# Altium project Main_Project.PrjPcb
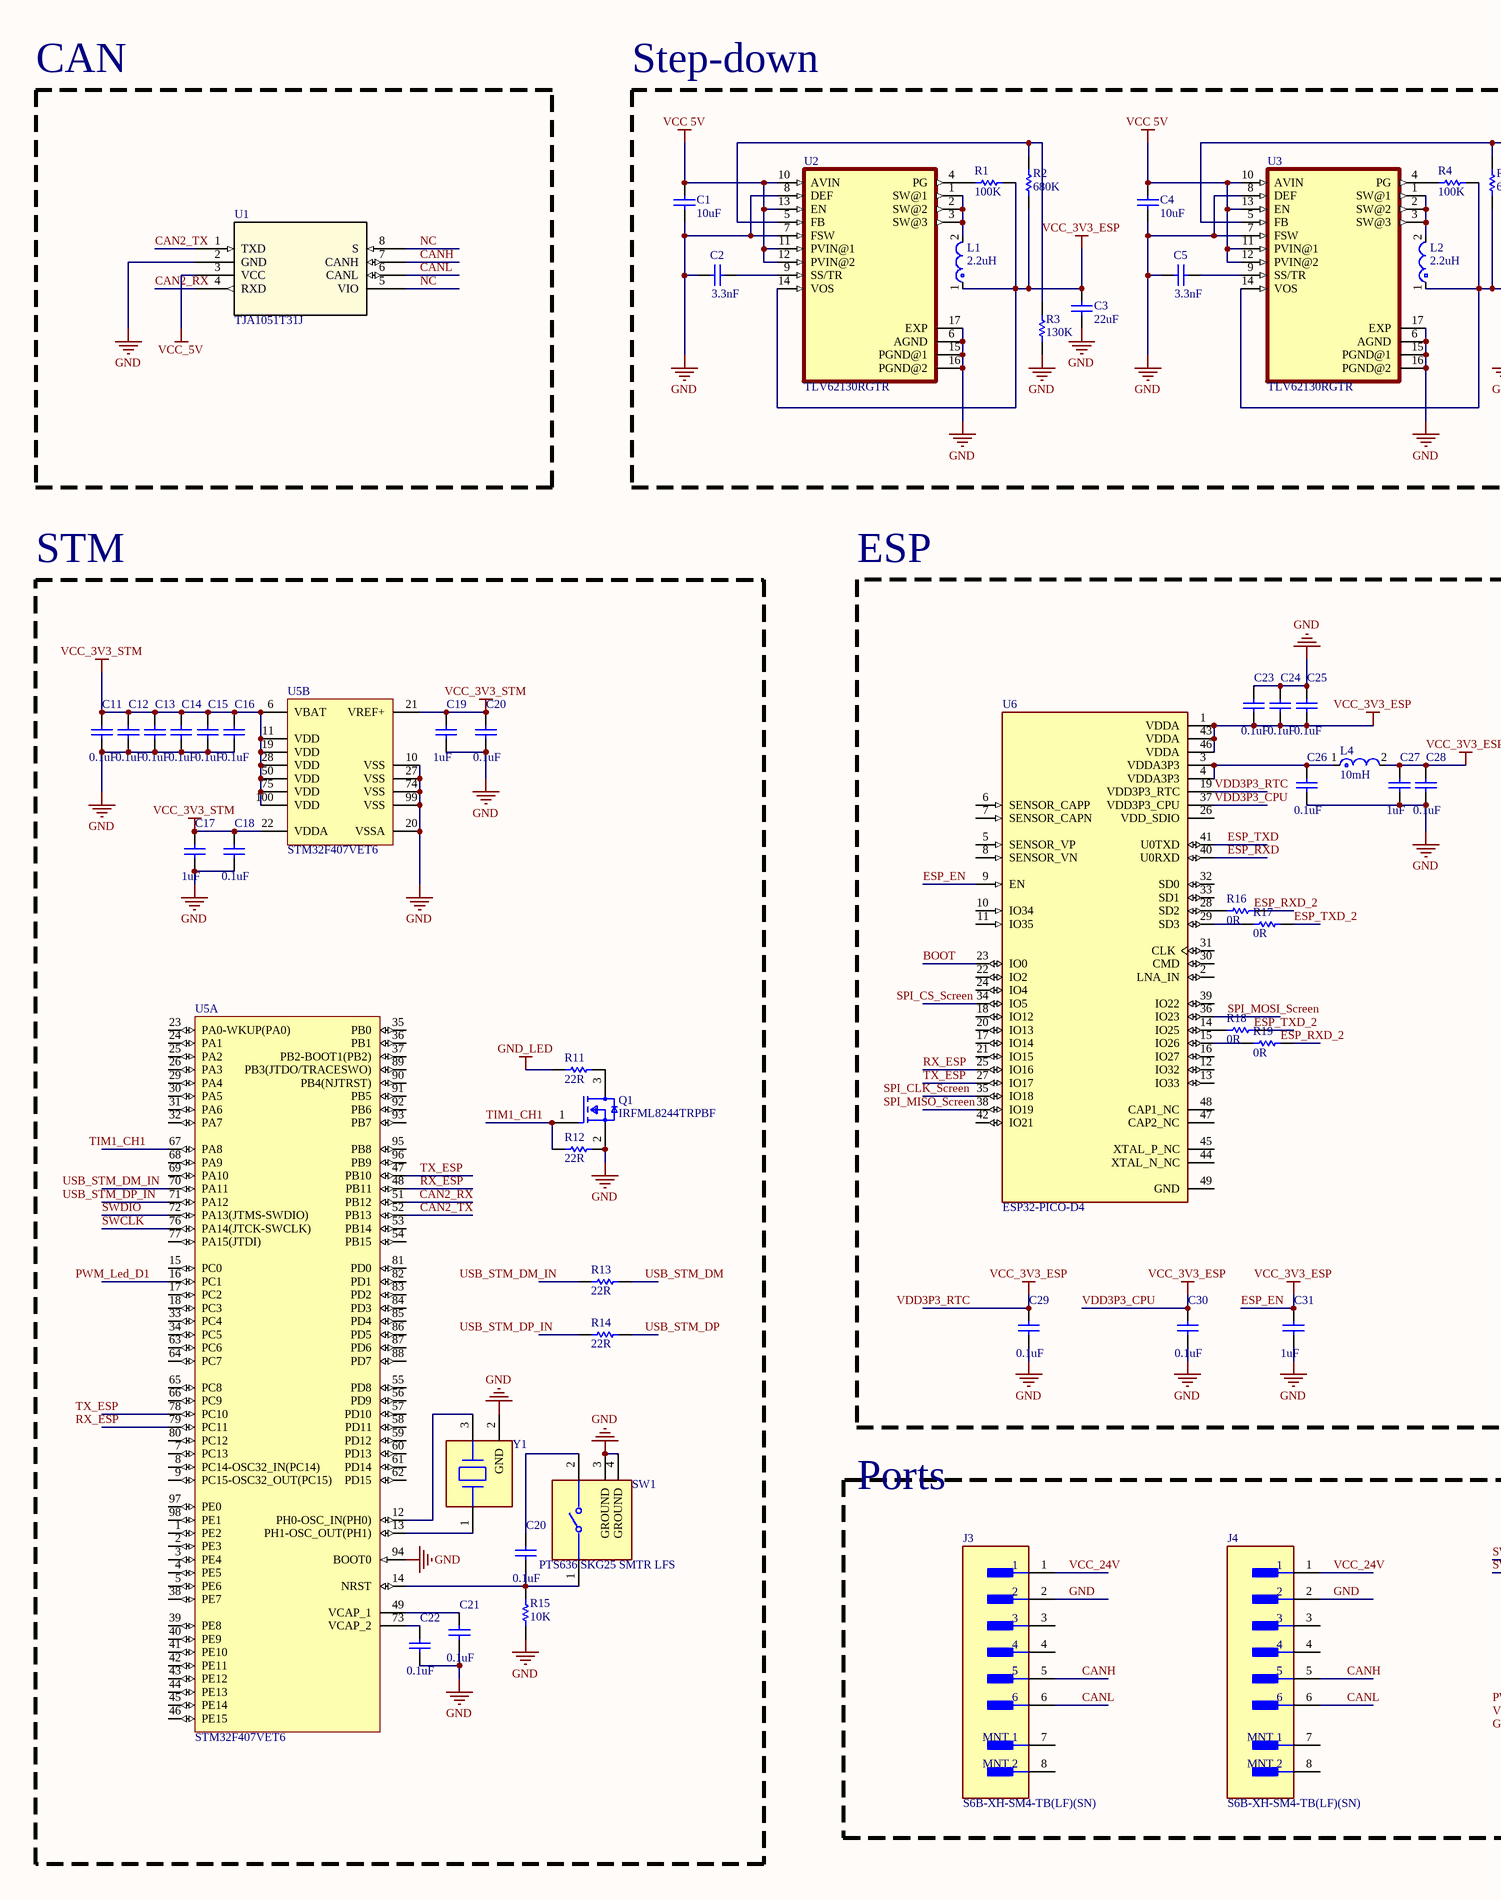
[diagram p0: Main.SchDoc, left]
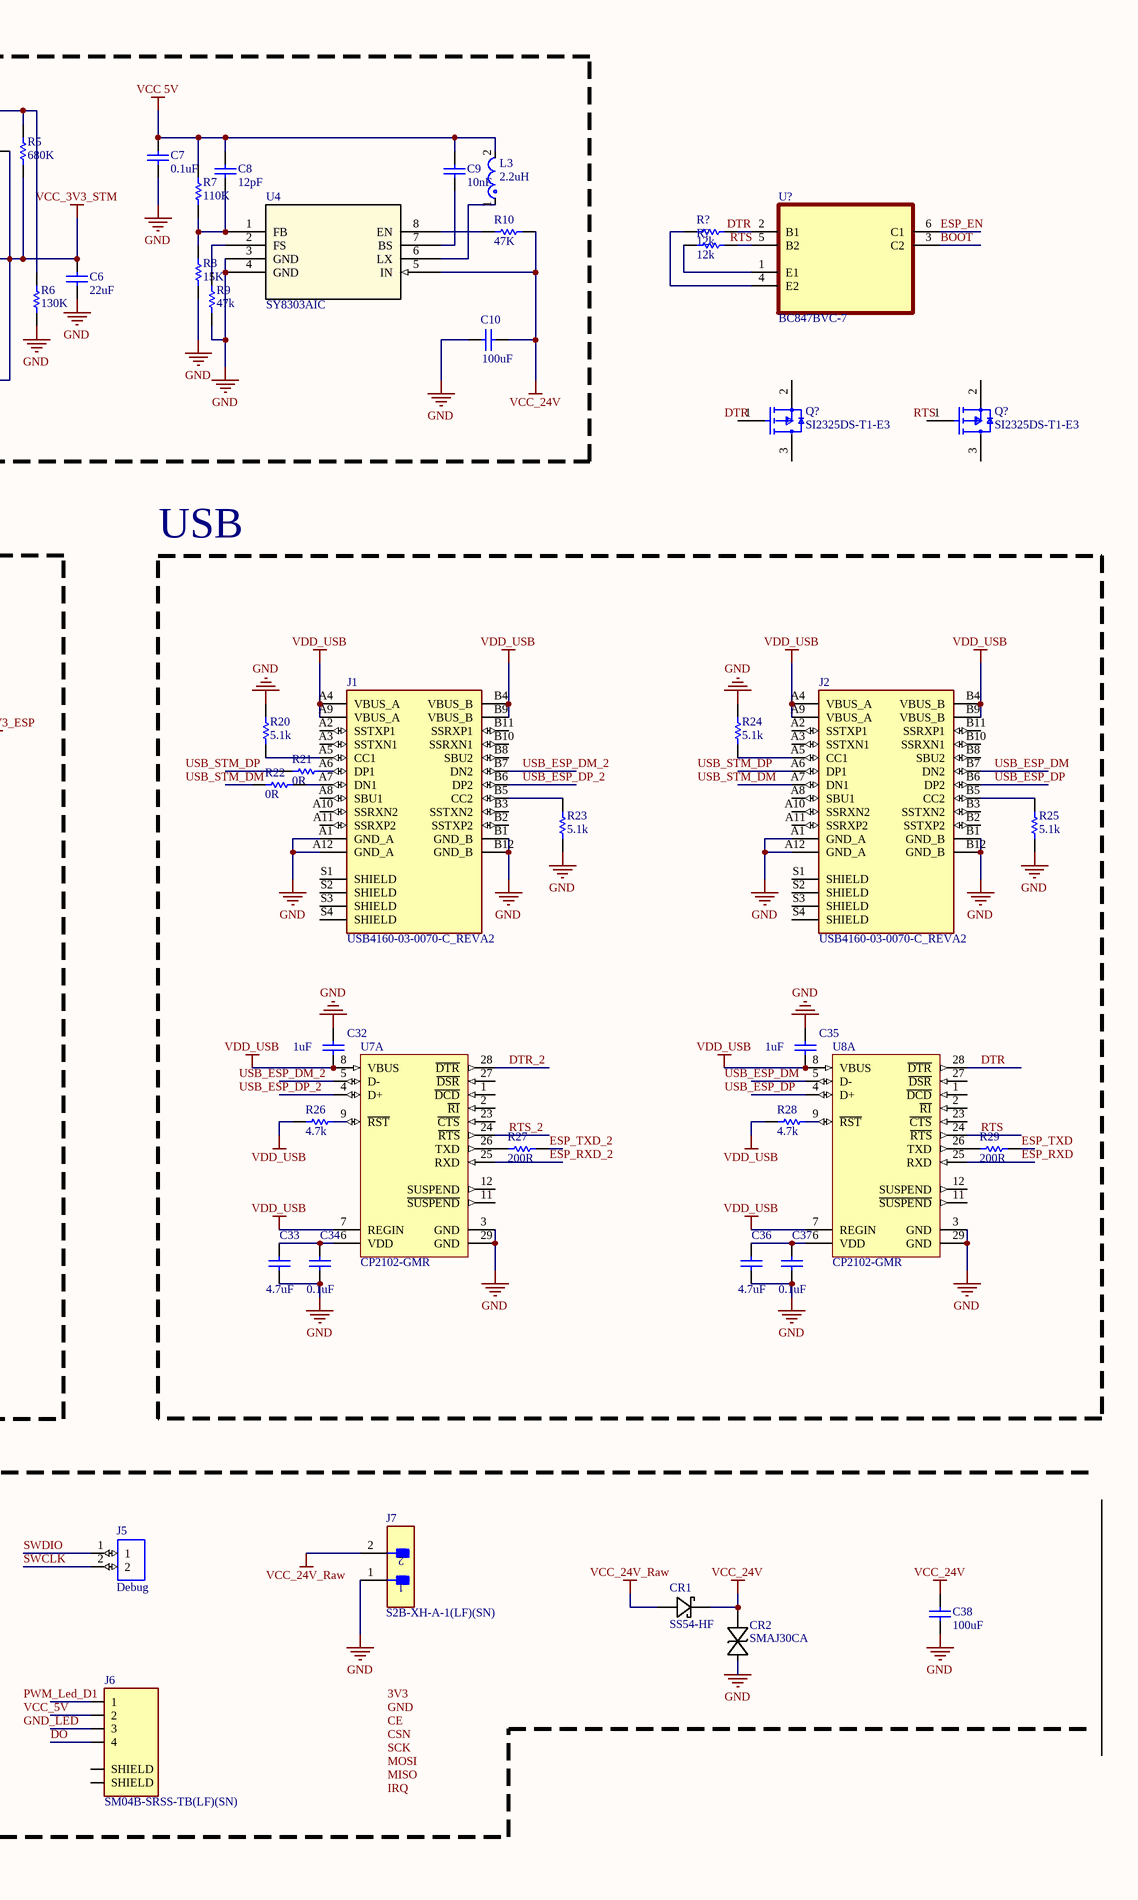
[diagram p1: Main.SchDoc, right]
1 sheet, 97 parts. Net scope: global (net labels, ports and power ports of the same name join across sheets).
Board files: Main.PcbDoc, Main-test.PcbDoc

## Sheet Main.SchDoc
size C; SheetNumber: 1; SheetTotal: 1

### Parts
(Parts that share a designator on the sheet are numbered #1, #2 ... from top to bottom, then left to right.)
C1  10uF  [CAPC1608X90X35ML10T15]
C2  3.3nF  [CAPC1608X90X35ML10T15]
C3  22uF  [CAPC1608X90X35ML10T15]
C4  10uF  [CAPC1608X90X35ML10T15]
C5  3.3nF  [CAPC1608X90X35ML10T15]
C6  22uF  [CAPC1608X90X35ML10T15]
C7  0.1uF  [CAPC1608X90X35ML10T15]
C8  12pF  [CAPC1608X90X35ML10T15]
C9  10nF  [CAPC1608X90X35ML10T15]
C10  100uF  [CAPC1608X90X35ML10T15]
C11  0.1uF  [CAPC1608X90X35ML10T15]
C12  0.1uF  [CAPC1608X90X35ML10T15]
C13  0.1uF  [CAPC1608X90X35ML10T15]
C14  0.1uF  [CAPC1608X90X35ML10T15]
C15  0.1uF  [CAPC1608X90X35ML10T15]
C16  0.1uF  [CAPC1608X90X35ML10T15]
C17  1uF  [CAPC1608X90X35ML10T15]
C18  0.1uF  [CAPC1608X90X35ML10T15]
C19  1uF  [CAPC1608X90X35ML10T15]
C20#1  0.1uF  [CAPC1608X90X35ML10T15]
C20#2  0.1uF  [CAPC1608X90X35ML10T15]
C21  0.1uF  [CAPC1608X90X35ML10T15]
C22  0.1uF  [CAPC1608X90X35ML10T15]
C23  0.1uF  [CAPC1608X90X35ML10T15]
C24  0.1uF  [CAPC1608X90X35ML10T15]
C25  0.1uF  [CAPC1608X90X35ML10T15]
C26  0.1uF  [CAPC1608X90X35ML10T15]
C27  1uF  [CAPC1608X90X35ML10T15]
C28  0.1uF  [CAPC1608X90X35ML10T15]
C29  0.1uF  [CAPC1608X90X35ML10T15]
C30  0.1uF  [CAPC1608X90X35ML10T15]
C31  1uF  [CAPC1608X90X35ML10T15]
C32  1uF  [CAPC1608X90X35ML10T15]
C33  4.7uF  [CAPC1608X90X35ML10T15]
C34  0.1uF  [CAPC1608X90X35ML10T15]
C35  1uF  [CAPC1608X90X35ML10T15]
C36  4.7uF  [CAPC1608X90X35ML10T15]
C37  0.1uF  [CAPC1608X90X35ML10T15]
C38  100uF  [CAPC1608X90X35ML10T15]
CR1  SS54-HF  [SDO_DO-214AC_CIP]
CR2  SMAJ30CA  [SMASeries_LTF]
J1  USB4160-03-0070-C_REVA2  [GCT_USB4160-03-0070-C_REVA2]
J2  USB4160-03-0070-C_REVA2  [GCT_USB4160-03-0070-C_REVA2]
J3  S6B-XH-SM4-TB(LF)(SN)  [FP-S6B-XH-SM4-TB_LF_SN-MFG]
J4  S6B-XH-SM4-TB(LF)(SN)  [FP-S6B-XH-SM4-TB_LF_SN-MFG]
J5  Debug  [SM02B-SRSS-TB(LF)(SN)]
J6  SM04B-SRSS-TB(LF)(SN)  [JST_SM04B-SRSS-TB(LF)(SN)]
J7  S2B-XH-A-1(LF)(SN)  [FP-S2B-XH-A-1_LF_SN-MFG]
L1  2.2uH  [FP-LQG18HH_00-MFG]
L2  2.2uH  [FP-LQG18HH_00-MFG]
L3  2.2uH  [FP-LQG18HH_00-MFG]
L4  10mH  [FP-LQG18HH_00-MFG]
Q1  IRFML8244TRPBF  [FP-PG-SOT23-3-IPC_A]
Q?#1  SI2325DS-T1-E3  [FP-S-03946-MFG]
Q?#2  SI2325DS-T1-E3  [FP-S-03946-MFG]
R1  100K  [RESC1608X55X30ML20T20]
R2  680K  [RESC1608X55X30ML20T20]
R3  130K  [RESC1608X55X30ML20T20]
R4  100K  [RESC1608X55X30ML20T20]
R5  680K  [RESC1608X55X30ML20T20]
R6  130K  [RESC1608X55X30ML20T20]
R7  110K  [RESC1608X55X30ML20T20]
R8  15K  [RESC1608X55X30ML20T20]
R9  47k  [RESC1608X55X30ML20T20]
R10  47K  [RESC1608X55X30ML20T20]
R11  22R  [RESC1608X55X30ML20T20]
R12  22R  [RESC1608X55X30ML20T20]
R13  22R  [RESC1608X55X30ML20T20]
R14  22R  [RESC1608X55X30ML20T20]
R15  10K  [RESC1608X55X30ML20T20]
R16  0R  [RESC1608X55X30ML20T20]
R17  0R  [RESC1608X55X30ML20T20]
R18  0R  [RESC1608X55X30ML20T20]
R19  0R  [RESC1608X55X30ML20T20]
R20  5.1k  [RESC1608X55X30ML20T20]
R21  0R  [RESC1608X55X30ML20T20]
R22  0R  [RESC1608X55X30ML20T20]
R23  5.1k  [RESC1608X55X30ML20T20]
R24  5.1k  [RESC1608X55X30ML20T20]
R25  5.1k  [RESC1608X55X30ML20T20]
R26  4.7k  [RESC1608X55X30ML20T20]
R27  200R  [RESC1608X55X30ML20T20]
R28  4.7k  [RESC1608X55X30ML20T20]
R29  200R  [RESC1608X55X30ML20T20]
R?#1  12k  [RESC1608X55X30ML20T20]
R?#2  12k  [RESC1608X55X30ML20T20]
SW1  PTS636 SKG25 SMTR LFS  [FP-PTS636_SKG25_SMTR_LFS-MFG]
U1  TJA1051T31J  [SO8_SOT96-1_NXP]
U2  TLV62130RGTR  [QFN50P300X300X100-17N]
U3  TLV62130RGTR  [QFN50P300X300X100-17N]
U4  SY8303AIC  [TSOT_303AIC_SGY]
U5  STM32F407VET6  [STM-LQFP100_N]  (parts A,B of 2)
U6  ESP32-PICO-D4  [PQFN50P700X700X104-49N]
U7  CP2102-GMR  [SLAB-QFN-28-3125x3125TP_M]  (part A of 2)
U8  CP2102-GMR  [SLAB-QFN-28-3125x3125TP_M]  (part A of 2)
U?  BC847BVC-7  [SOT50P160X60-6N]
Y1  (no value)  [FP-CSTCE_V-MFG]

### Blocks framed on the sheet
CAN: U1
Step-down: C1-C10 L1-L3 R1-R10 U2-U4
STM: C11-C19 C20#1 C20#2 C21 C22 Q1 R11-R15 SW1 U5 Y1
ESP: C23-C31 L4 R16-R19 U6
USB: C32-C37 J1 J2 R20-R29 U7 U8

### Nets
ESP_EN: C3.2 C23.1 C24.1 C25.1 C27.2 C28.2 C29.2 C30.2 C31.2 L1.1 L4.2 R1.2 R2.1 U2.14(VOS) U6.1(VDDA) U6.9(EN) U6.37(VDD3P3_CPU) U6.43(VDDA) U6.46(VDDA) U?.6(C1)  [also labelled VCC_3V3_ESP, VDD3P3_CPU]
GND: C1.1 C2.1 C3.1 C4.1 C5.1 C6.1 C7.1 C10.1 C11.1 C12.1 C13.1 C14.1 C15.1 C16.1 C17.1 C18.1 C19.1 C20#1.1 C21.1 C22.1 C23.2 C24.2 C25.2 C26.1 C27.1 C28.1 C29.1 C30.1 C31.1 C32.2 C33.1 C34.1 C35.2 C36.1 C37.1 C38.1 CR2.2 J1.A1(GND_A) J1.A12(GND_A) J1.B1(GND_B) J1.B12(GND_B) J2.A1(GND_A) J2.A12(GND_A) J2.B1(GND_B) J2.B12(GND_B) J3.2 J4.2 J7.1 Q1.2(S) R3.1 R6.1 R8.1 R9.1 R12.2 R15.1 R20.2 R23.1 R24.2 R25.1 SW1.3(GROUND) SW1.4(GROUND) U1.2(GND) U2.6(AGND) U2.7(FSW) U2.8(DEF) U2.15(PGND@1) U2.16(PGND@2) U2.17(EXP) U3.6(AGND) U3.7(FSW) U3.8(DEF) U3.15(PGND@1) U3.16(PGND@2) U3.17(EXP) U4.3(GND) U4.4(GND) U5.10(VSS) U5.20(VSSA) U5.27(VSS) U5.74(VSS) U5.94(BOOT0) U5.99(VSS) U7.3(GND) U7.29(GND) U8.3(GND) U8.29(GND) Y1.2(GND)
GND_LED: R11.1
VCC 5V: C1.2 C4.2 C7.2 C8.2 C9.2 L3.2 R7.2 U2.10(AVIN) U2.11(PVIN@1) U2.12(PVIN@2) U2.13(EN) U3.10(AVIN) U3.11(PVIN@1) U3.12(PVIN@2) U3.13(EN)
VCC_3V3_STM: C6.2 C11.2 C12.2 C13.2 C14.2 C15.2 C16.2 C17.2 C18.2 C19.2 C20#1.2 L2.1 R4.2 R5.1 U3.14(VOS) U5.6(VBAT) U5.11(VDD) U5.19(VDD) U5.21(VREF+) U5.22(VDDA) U5.28(VDD) U5.50(VDD) U5.75(VDD) U5.100(VDD)
VCC_5V: U1.3(VCC)
VCC_24V: C10.2 C38.2 CR1.1(CATHODE) CR2.1 J3.1 J4.1 R10.2 U4.5(IN)
VCC_24V_Raw: CR1.2(ANODE) J7.2
VDD_USB: C32.1 C35.1 J1.A4(VBUS_A) J1.A9(VBUS_A) J1.B4(VBUS_B) J1.B9(VBUS_B) J2.A4(VBUS_A) J2.A9(VBUS_A) J2.B4(VBUS_B) J2.B9(VBUS_B) R26.1 R28.1 U7.7(REGIN) U7.8(VBUS) U8.7(REGIN) U8.8(VBUS)
BOOT: U6.23(IO0) U?.3(C2)
CAN2_RX: U1.4(RXD) U5.51(PB12)
CAN2_TX: U1.1(TXD) U5.52(PB13)
CANH: J3.5 J4.5 U1.7(CANH)
CANL: J3.6 J4.6 U1.6(CANL)
DO: J6.4
DTR: U8.28(~{DTR})
DTR_2: U7.28(~{DTR})
ESP_RXD: U6.40(U0RXD) U8.25(RXD)
ESP_RXD_2: U7.25(RXD)
ESP_TXD: R29.2 U6.41(U0TXD)
ESP_TXD_2: R17.2 R27.2
NC: U1.5(VIO) U1.8(S)
RTS: U8.24(~{RTS})
RTS_2: U7.24(~{RTS})
RX_ESP: U5.48(PB11) U6.25(IO16)
SPI_MOSI_Screen: U6.36(IO23)
SWCLK: J5.2 U5.76(PA14(JTCK-SWCLK))
SWDIO: J5.1 U5.72(PA13(JTMS-SWDIO))
TIM1_CH1: Q1.1(G) R12.1
TX_ESP: U5.47(PB10) U6.27(IO17)
USB_ESP_DM: J2.B7(DN2)
USB_ESP_DM_2: J1.B7(DN2)
USB_ESP_DP: J2.B6(DP2)
USB_ESP_DP_2: J1.B6(DP2)
USB_STM_DM: R13.2
USB_STM_DP: R14.2
VDD3P3_RTC: U6.19(VDD3P3_RTC)
NetC2_2: C2.2 U2.9(SS/TR)
NetC5_2: C5.2 U3.9(SS/TR)
NetC8_1: C8.1 R7.1 R8.2 U4.1(FB)
NetC9_1: C9.1 U4.7(BS)
NetC20#2_1: C20#2.1 R15.2 SW1.1 U5.14(NRST)
NetC20#2_2: C20#2.2 SW1.2
NetC21_2: C21.2 U5.49(VCAP_1)
NetC22_2: C22.2 U5.73(VCAP_2)
NetC26_2: C26.2 L4.1 U6.3(VDDA3P3) U6.4(VDDA3P3)
NetC33_2: C33.2 C34.2 U7.6(VDD)
NetC36_2: C36.2 C37.2 U8.6(VDD)
NetJ1_A5: J1.A5(CC1) R20.1
NetJ1_A6: J1.A6(DP1) R21.2
NetJ1_A7: J1.A7(DN1) R22.2
NetJ1_B5: J1.B5(CC2) R23.2
NetJ2_A5: J2.A5(CC1) R24.1
NetJ2_B5: J2.B5(CC2) R25.2
NetL1_2: L1.2 U2.1(SW@1) U2.2(SW@2) U2.3(SW@3)
NetL2_2: L2.2 U3.1(SW@1) U3.2(SW@2) U3.3(SW@3)
NetL3_1: L3.1 U4.6(LX)
NetQ1_3: Q1.3(D) R11.2
NetR1_1: R1.1 U2.4(PG)
NetR2_2: R2.2 R3.2 U2.5(FB)
NetR4_1: R4.1 U3.4(PG)
NetR5_2: R5.2 R6.2 U3.5(FB)
NetR9_2: R9.2 U4.2(FS)
NetR10_1: R10.1 U4.8(EN)
NetR16_1: R16.1 U6.28(SD2)
NetR17_1: R17.1 U6.29(SD3)
NetR18_1: R18.1 U6.14(IO25)
NetR19_1: R19.1 U6.15(IO26)
NetR26_2: R26.2 U7.9(~{RST})
NetR27_1: R27.1 U7.26(TXD)
NetR28_2: R28.2 U8.9(~{RST})
NetR29_1: R29.1 U8.26(TXD)
NetR?#1_1: R?#1.1 U?.4(E2)
NetR?#1_2: R?#1.2 U?.2(B1)
NetR?#2_1: R?#2.1 U?.1(E1)
NetR?#2_2: R?#2.2 U?.5(B2)
NetU5_12: U5.12(PH0-OSC_IN(PH0)) Y1.3(Output)
NetU5_13: U5.13(PH1-OSC_OUT(PH1)) Y1.1(Input)

Not connected (* = marked no-connect by the designer): J1 A2(SSTXP1) A3(SSTXN1) A8(SBU1) A10(SSRXN2) A11(SSRXP2) B2(SSTXP2) B3(SSTXN2) B8(SBU2) B10(SSRXN1) B11(SSRXP1) S1(SHIELD) S2(SHIELD) S3(SHIELD) S4(SHIELD); J2 A2(SSTXP1) A3(SSTXN1) A6(DP1) A7(DN1) A8(SBU1) A10(SSRXN2) A11(SSRXP2) B2(SSTXP2) B3(SSTXN2) B8(SBU2) B10(SSRXN1) B11(SSRXP1) S1(SHIELD) S2(SHIELD) S3(SHIELD) S4(SHIELD); J3 3 4 7(MNT_1) 8(MNT_2); J4 3 4 7(MNT_1) 8(MNT_2); J6 1 2 3 S1(SHIELD) S2(SHIELD); Q?#1 1(G) 2(S) 3(D); Q?#2 1(G) 2(S) 3(D); R13 1; R14 1; R16 2; R18 2; R19 2; R21 1; R22 1; U5 1(PE2) 2(PE3) 3(PE4) 4(PE5) 5(PE6) 7(PC13) 8(PC14-OSC32_IN(PC14)) 9(PC15-OSC32_OUT(PC15)) 15(PC0) 16(PC1) 17(PC2) 18(PC3) 23(PA0-WKUP(PA0)) 24(PA1) 25(PA2) 26(PA3) 29(PA4) 30(PA5) 31(PA6) 32(PA7) 33(PC4) 34(PC5) 35(PB0) 36(PB1) 37(PB2-BOOT1(PB2)) 38(PE7) 39(PE8) 40(PE9) 41(PE10) 42(PE11) 43(PE12) 44(PE13) 45(PE14) 46(PE15) 53(PB14) 54(PB15) 55(PD8) 56(PD9) 57(PD10) 58(PD11) 59(PD12) 60(PD13) 61(PD14) 62(PD15) 63(PC6) 64(PC7) 65(PC8) 66(PC9) 67(PA8) 68(PA9) 69(PA10) 70(PA11) 71(PA12) 77(PA15(JTDI)) 78(PC10) 79(PC11) 80(PC12) 81(PD0) 82(PD1) 83(PD2) 84(PD3) 85(PD4) 86(PD5) 87(PD6) 88(PD7) 89(PB3(JTDO/TRACESWO)) 90(PB4(NJTRST)) 91(PB5) 92(PB6) 93(PB7) 95(PB8) 96(PB9) 97(PE0) 98(PE1); U6 2(LNA_IN) 5(SENSOR_VP) 6(SENSOR_CAPP) 7(SENSOR_CAPN) 8(SENSOR_VN) 10(IO34) 11(IO35) 12(IO32) 13(IO33) 16(IO27) 17(IO14) 18(IO12) 20(IO13) 21(IO15) 22(IO2) 24(IO4) 26(VDD_SDIO) 30(CMD) 31(CLK) 32(SD0) 33(SD1) 34(IO5) 35(IO18) 38(IO19) 39(IO22) 42(IO21) 44(XTAL_N_NC) 45(XTAL_P_NC) 47(CAP2_NC) 48(CAP1_NC) 49(GND); U7 1(~{DCD}) 2(~{RI}) 4(D+) 5(D-) 11(~{SUSPEND}) 12(SUSPEND) 23(~{CTS}) 27(~{DSR}); U8 1(~{DCD}) 2(~{RI}) 4(D+) 5(D-) 11(~{SUSPEND}) 12(SUSPEND) 23(~{CTS}) 27(~{DSR})

### Notes on the sheet
- Ports
- Labels drawn without touching a wire or pin: 3V3, CE, CSN, DTR, ESP_RXD_2, ESP_TXD_2, GND, GND_LED, IRQ, MISO, MOSI, PWM_Led_D1, RTS, RX_ESP, SCK, SPI_CLK_Screen, SPI_CS_Screen, SPI_MISO_Screen, TIM1_CH1, TX_ESP, USB_ESP_DM, USB_ESP_DM_2, USB_ESP_DP, USB_ESP_DP_2, USB_STM_DM, USB_STM_DM_IN, USB_STM_DP, USB_STM_DP_IN, VCC_5V, VDD3P3_RTC

### Library data of the parts
C1-C19 C20#1 C20#2 C21-C38 = CMP-2006-02924-1: Part Number: GRM188R71H472KA01D; Manufacturer: Murata
CR1 = SS54-HF: No Description Available; Mfr_Name: Comchip; Type: Diodes - Rectifiers, Single
CR2 = SMAJ30CA: No Description Available; Mfr_Name: Littelfuse Inc
J3 J4 = CMP-17439-000164-1: CONN HEADER SMD R/A 6POS 2.5MM; Gender: Male; Number of Positions: 6; Max Current Rating: 3A; Voltage Rating: 250V; Contact Resistance: 20mR; Flammability Rating: UL94 V-0; Orientation: Right Angle; Contact Finish - Mating: TIN; Packaging: Tape and Reel; Termination: Solder; Pitch: 2.5mm; Housing Color: Beige; Insulation Material: Nylon; Fastening Type: Detent; Housing Material: Polyamide; Package Quantity: 1; Mount: Surface Mount; Insulation Color: Natural; Series: XH; Depth: 7mm; Contact Shape: Square; Color: Natural; Max Voltage Rating (AC): 250V; Min Operating Temperature: -25°C; Number of Contacts: 6; Lead Free: Lead Free; Contact Material: Copper Alloy; Contact Type: Male Pin; Length: 20mm; Max Operating Temperature: 85°C; Connector Type: Header; Number of Rows: 1; REACH SVHC: No SVHC; Contact Plating: Copper
J5 = SM02B-SRSS-TB(LF)(SN): Connector Header Surface Mount, Right Angle 2 position 0.039 _1.00mm_; MP: SM02B-SRSS-TB_LF__SN_; MF: JST Sales; SnapEDA_Link: https://www.snapeda.com/parts/SM02B-SRSS-TB%28LF%29%28SN%29/JST%20Sales%20America%20Inc./view-part/447499/?ref=snap; Price: None; Value: *; Availability: Unavailable; Package: None
J6 = SM04B-SRSS-TB(LF)(SN): SH Series 1.0 mm Pitch 2 Position Single Row Side Entry Shrouded Header; Price: None; Value: *; MP: SM04B-SRSS-TB(LF)(SN); Package: None; Availability: Unavailable
J7 = CMP-17439-000260-1: CONN HEADER R/A 2POS 2.5MM; Voltage Rating: 250V; Number of Positions: 2; Contact Material: Brass; Series: XH; Contact Finish - Mating: TIN; Max Operating Temperature: 85°C; Number of Rows: 1; Packaging: Bulk; Insulation Color: Natural; Lead Free: Lead Free; Fastening Type: Detent; Termination: Press-Fit; Connector Type: Header; Insulation Material: Nylon; Contact Shape: Square; Contact Type: Male Pin; Mount: Through Hole; Min Operating Temperature: -25°C; Flammability Rating: UL94 V-0
L1-L4 = CMP-06042-006563-1: Multilayer type RF Inductor 68nH ±5% 0.8Ω 400mA 0603; Core Material: Air; DC Current: 300mA; Q Factor: 12; Test Frequency: 100MHz; DC Resistance (DCR): 800mR; Shielding: Unshielded; Self Resonant Frequency: 1GHz; Termination: SMD/SMT; Mount: Surface Mount; Case Code (Imperial): 0603; Height: 0.031inch; Tolerance: 5%; Inductance Tolerance: 5%; Package Quantity: 4000; Width: 0.8mm; Length: 0.063inch; Inductance: 68nH; Depth: 0.95mm; Case Code (Metric): 1608; Max DC Current: 300mA; Case/Package: 0603; Military Standard: Not; Min Operating Temperature: -55°C; REACH SVHC: No SVHC; Number of Pins: 2; Max Operating Temperature: 85°C; Lead Free: Lead Free; Current Rating: 300mA; Radiation Hardening: No; Packaging: Tape and Reel
Q1 = CMP-00196-65874012-1: IRFML8244TRPBF Trans MOSFET N-CH 25V 5.8A 3-Pin SOT-23 T/R - Product that comes on tape, but is not reeled; Manufacturer Package Identifier: Micro3; Max Power Dissipation: 1.25W; Rise Time: 2.1ns; Number of Elements: 1; Drain to Source Resistance: 41mΩ; Fall Time: 2.9ns; On-State Resistance: 24mΩ; Gate to Source Voltage (Vgs): 20V; Turn-Off Delay Time: 9ns; Nominal Vgs: 1.7V; Max Junction Temperature (Tj): 150°C; Turn-On Delay Time: 2.7ns; Element Configuration: Single; Recovery Time: 17ns; Input Capacitance: 430pF; Case/Package: SOT-23; REACH SVHC: No SVHC; Drain to Source Breakdown Voltage: 25V; Length: 3.04mm; Height: 1.02mm; Schedule B: 8541290080, 8541290080; Max Operating Temperature: 150°C; Mount: Surface Mount; Resistance: 41MΩ; Width: 1.4mm; Continuous Drain Current (ID): 5.8A; NexarPartId: 65874012; Rds On Max: 24mΩ; Power Dissipation: 1.25W; Lead Free: Lead Free; RoHS: Compliant; Packaging: Tape & Reel; Package Quantity: 3000; Lifecycle Status: Production; Radiation Hardening: No; Drain to Source Voltage (Vdss): 25V; Threshold Voltage: 1.7V; Number of Pins: 3; Min Operating Temperature: -55°C
Q?#1 Q?#2 = CMP-02550-000143-1: MOSFET P-CH 150V 0.53A SOT23-3; Manufacturer: Vishay; Transconductance: 2.2S; Reverse Recovery Charge: 90nC; Number Of Channels: 1; Depletion Mode: False; Continuous Drain Current: -0.53A; Gate Charge At Vgs: 7.7nC @ 10V; Threshold Vgs Min: -2.5V; Threshold Vgs Max: -4.5V; Drain To Source Breakdown Voltage: -150V; Turn Off Delay Time: 16ns; Pulse Drain Current: -1.6A; Power Dissipation: 0.75W; Gate To Source Voltage: 20V; Turn On Delay Time: 7ns; Max Junction Temp: +150°C; Standoff Height: 0.01mm; Max Forward Diode Voltage: -1.2V; Rthja Max: 120°C/W; Typ Forward Diode Voltage: 0.7V; Drain To Source Resistance: 1Ω; Input Capacitace At Vds: 340pF @ -25V; Manufacturer Part Number: SI2325DS-T1-E3; Ipc Land Pattern Name: SOT95P237X100-3; Height: 1.12mm; ComponentLink2Description: Datasheet; Temperature Range High: +150°C; Temperature: -55°C to +150°C; Drain To Source Voltage: -150V; Category: Trans; RoHS: TRUE; Digikey Description: MOSFET P-CH 150V 0.53A SOT23-3; Lead Free: Yes; Temperature Range Low: -55°C; ComponentLink2URL: https://www.vishay.com/docs/73238/73238.pdf; Automotive: No; Device Class L1: Discrete Semiconductors; Device Class L3: MOSFETs; Octopart: https://octopart.com/si2325ds-t1-e3-vishay-42272082; Mouser Description: MOSFET 150V 0.69A 0.75W; Package: S-03946; Device Class L2: Transistors; Number Of P Channels: 1
R1-R29 R?#1 R?#2 = CMP-2000-00054-1: Part Number: ERA3AEB392V; Manufacturer: Panasonic
SW1 = CMP-10040-000025-1: TACT 6.0 X 3.5, 2.5 MM H, 250GF,
U1 = TJA1051T31J: No Description Available; Mfr_Name: NXP; RefDes: RefDes; Type: Type
U2 U3 = TLV62130RGTR: 3-17V 3A Step-Down Converter in 3x3 QFN Package 16-VQFN -40 to 85; MF: Texas Instruments; Mouser-Purchase-URL: https://snapeda.com/shop?store=Mouser&id=423292; MP: TLV62130RGTR; Value: *; DigiKey-Purchase-URL: https://snapeda.com/shop?store=DigiKey&id=423292; Package: VQFN-16 Texas Instruments; Texas_Instruments-Purchase-URL: https://snapeda.com/shop?store=Texas+Instruments&id=423292; Price: None; Availability: Unavailable; SnapEDA_Link: https://www.snapeda.com/parts/TLV62130RGTR/Texas%20Instruments/view-part/423292/?ref=snap
U4 = SY8303AIC: No Description Available; Mfr_Name: Silergy; RefDes: RefDes; Type: Type
U5 = STM32F407VET6: ARM Cortex-M4 32-bit MCU+FPU, 210 DMIPS, 512 kB Flash, 192 kB Internal RAM, 82 I/Os, 100-pin LQFP, -40 to 85 degC, Tray; Manufacturer: STMicroelectronics; D/A Converter: 2x12-bit; FLASH Size (Prog) (kB): 512; I/Os (High Current): 82; Internal RAM Size (kB): 192; Operating Frequency(F) (Processor speed) (MHz): 168; Supply Voltage(Vcc) max (V): 3.6; Supply Voltage(Vcc) min (V): 1.8; DatasheetVersion: Rev. 4; PackageVersion: Rev. 1, 06/2013; PackageReference: LQFP100; PackageDescription: 100-Pin Low Profile Quad Flat Package, 14 x 14 mm Body, 0.5 mm Pitch; Supplier 1: Digi-Key; Supplier Part Number 1: 497-12075-ND; Supplier 2: Farnell; Supplier Part Number 2: 2064367; Supplier 3: Newark; Supplier Part Number 3: 73T2332; Supplier 4: Mouser; Supplier Part Number 4: 511-STM32F407VET6; Core: ARM Cortex-M4; Packing: Tray; Mounting Technology: Surface Mount; PartNumber: STM32F407VET6; ComponentLink1Description: Manufacturer URL; ComponentLink1URL: http://www.st.com/web/en/home.html; ComponentLink2Description: Datasheet; ComponentLink2URL: http://www.st.com/st-web-ui/static/active/en/resource/technical/document/datasheet/DM00037051.pdf; ComponentLink3Description: Package Specification; ComponentLink3URL: http://www.st.com/st-web-ui/static/active/en/resource/technical/document/data_brief/DM00071938.pdf
U6 = ESP32-PICO-D4: Bluetooth, WiFi 802.11b/g/n, Bluetooth v4.2 +EDR, Class 1, 2 and 3 Transceiver Module 2.4GHz ~ 2.5GHz Surface Mount; Value: *; Availability: Unavailable; Price: None; MP: ESP32-PICO-D4; Package: None
U7 U8 = CMP-2000-04924-1: Single-Chip USB to URAT Bridge, 3.3 V, -40 to 85 degC, 28-Pin QFN, RoHS, Tape and Reel; Manufacturer: Silicon Labs; Interface Circuit Standard 1: RS-232; Transmitter and Receiver FIFO Counter: No; Supply Current: 26mA; Operating Supply Voltage (Min): 3V; Operating Supply Voltage (Typ): 3.3V; Data Rate: 1000kbps; Operating Supply Voltage (Max): 3.6V; Number of Channels: 1; Package URL: http://www.silabs.com/Support%20Documents/TechnicalDocs/C8051T61x.pdf; Operating Temperature (Max): 85C; Datasheet URL: http://www.mouser.com/ds/2/368/CP2102-9-247052.pdf; Operating Temperature Classification: Industrial; Operating Temperature (Min): -40C; Package Description: 28-Pin Quad-Flat No-Leads Package, Body 5 x 5 mm, Pitch 0.5 mm; Manufacturer URL: http://www.silabs.com/; Rad Hardened: No; Package Reference: QFN-28; Pin Count: 28; Packaging: TapeandReel; Mounting: SurfaceMount; Package Type: QFNEP; Datasheet Version: Rev. 1.6, 12/2013
U? = BC847BVC-7: Bipolar (BJT) Transistor Array 2 NPN (Dual) 45V 100mA 100MHz 150mW Surface Mount SOT-563; MF: Diodes Inc.; Price: None; Value: *; Purchase-URL: https://pricing.snapeda.com/search/part/BC847BVC-7/?ref=eda; Check_prices: https://www.snapeda.com/parts/BC847BVC-7/Diodes+Inc./view-part/?ref=eda; Package: SOT-563 Diodes Inc.; Availability: In Stock; SnapEDA_Link: https://www.snapeda.com/parts/BC847BVC-7/Diodes+Inc./view-part/?ref=snap; MP: BC847BVC-7
Y1 = CMP-06057-000013-1: CERAMIC RES 20.0000MHZ 15PF SMD; Self Resonant Frequency: 20MHz; Frequency Stability: 0.3%; Tolerance: 0.5%; Impedance: 40R; Height: 0.039inch; Package Quantity: 3000; Capacitance: 15pF; Mount: Surface Mount; Length: 0.126inch; Load Capacitance: 15pF; Resistor Type: Ceramic; Width: 0.051inch; Termination: SMD/SMT; Frequency Tolerance: 0.5%; Case/Package: SMD/SMT; Contact Plating: Gold; Lead Free: Lead Free; Number of Pins: 3; Packaging: Tape and Reel; Min Operating Temperature: -20°C; REACH SVHC: No SVHC; Max Operating Temperature: 80°C; Frequency: 20MHz
J1 J2 = USB4160-03-0070-C_REVA2: Price: None; Value: *; Package: None; Availability: Unavailable; MP: USB4160-03-0070-C_REVA2